# EasyEDA schematic SCH_ATC-PCB-SMD-V1.5_2024-12-07.json
TITLE: Sheet_1; REV: 1.0; Date: 2024-07-21; Sheet: 1/1; Drawn By: Edward Niedziejko; Company: Your Company
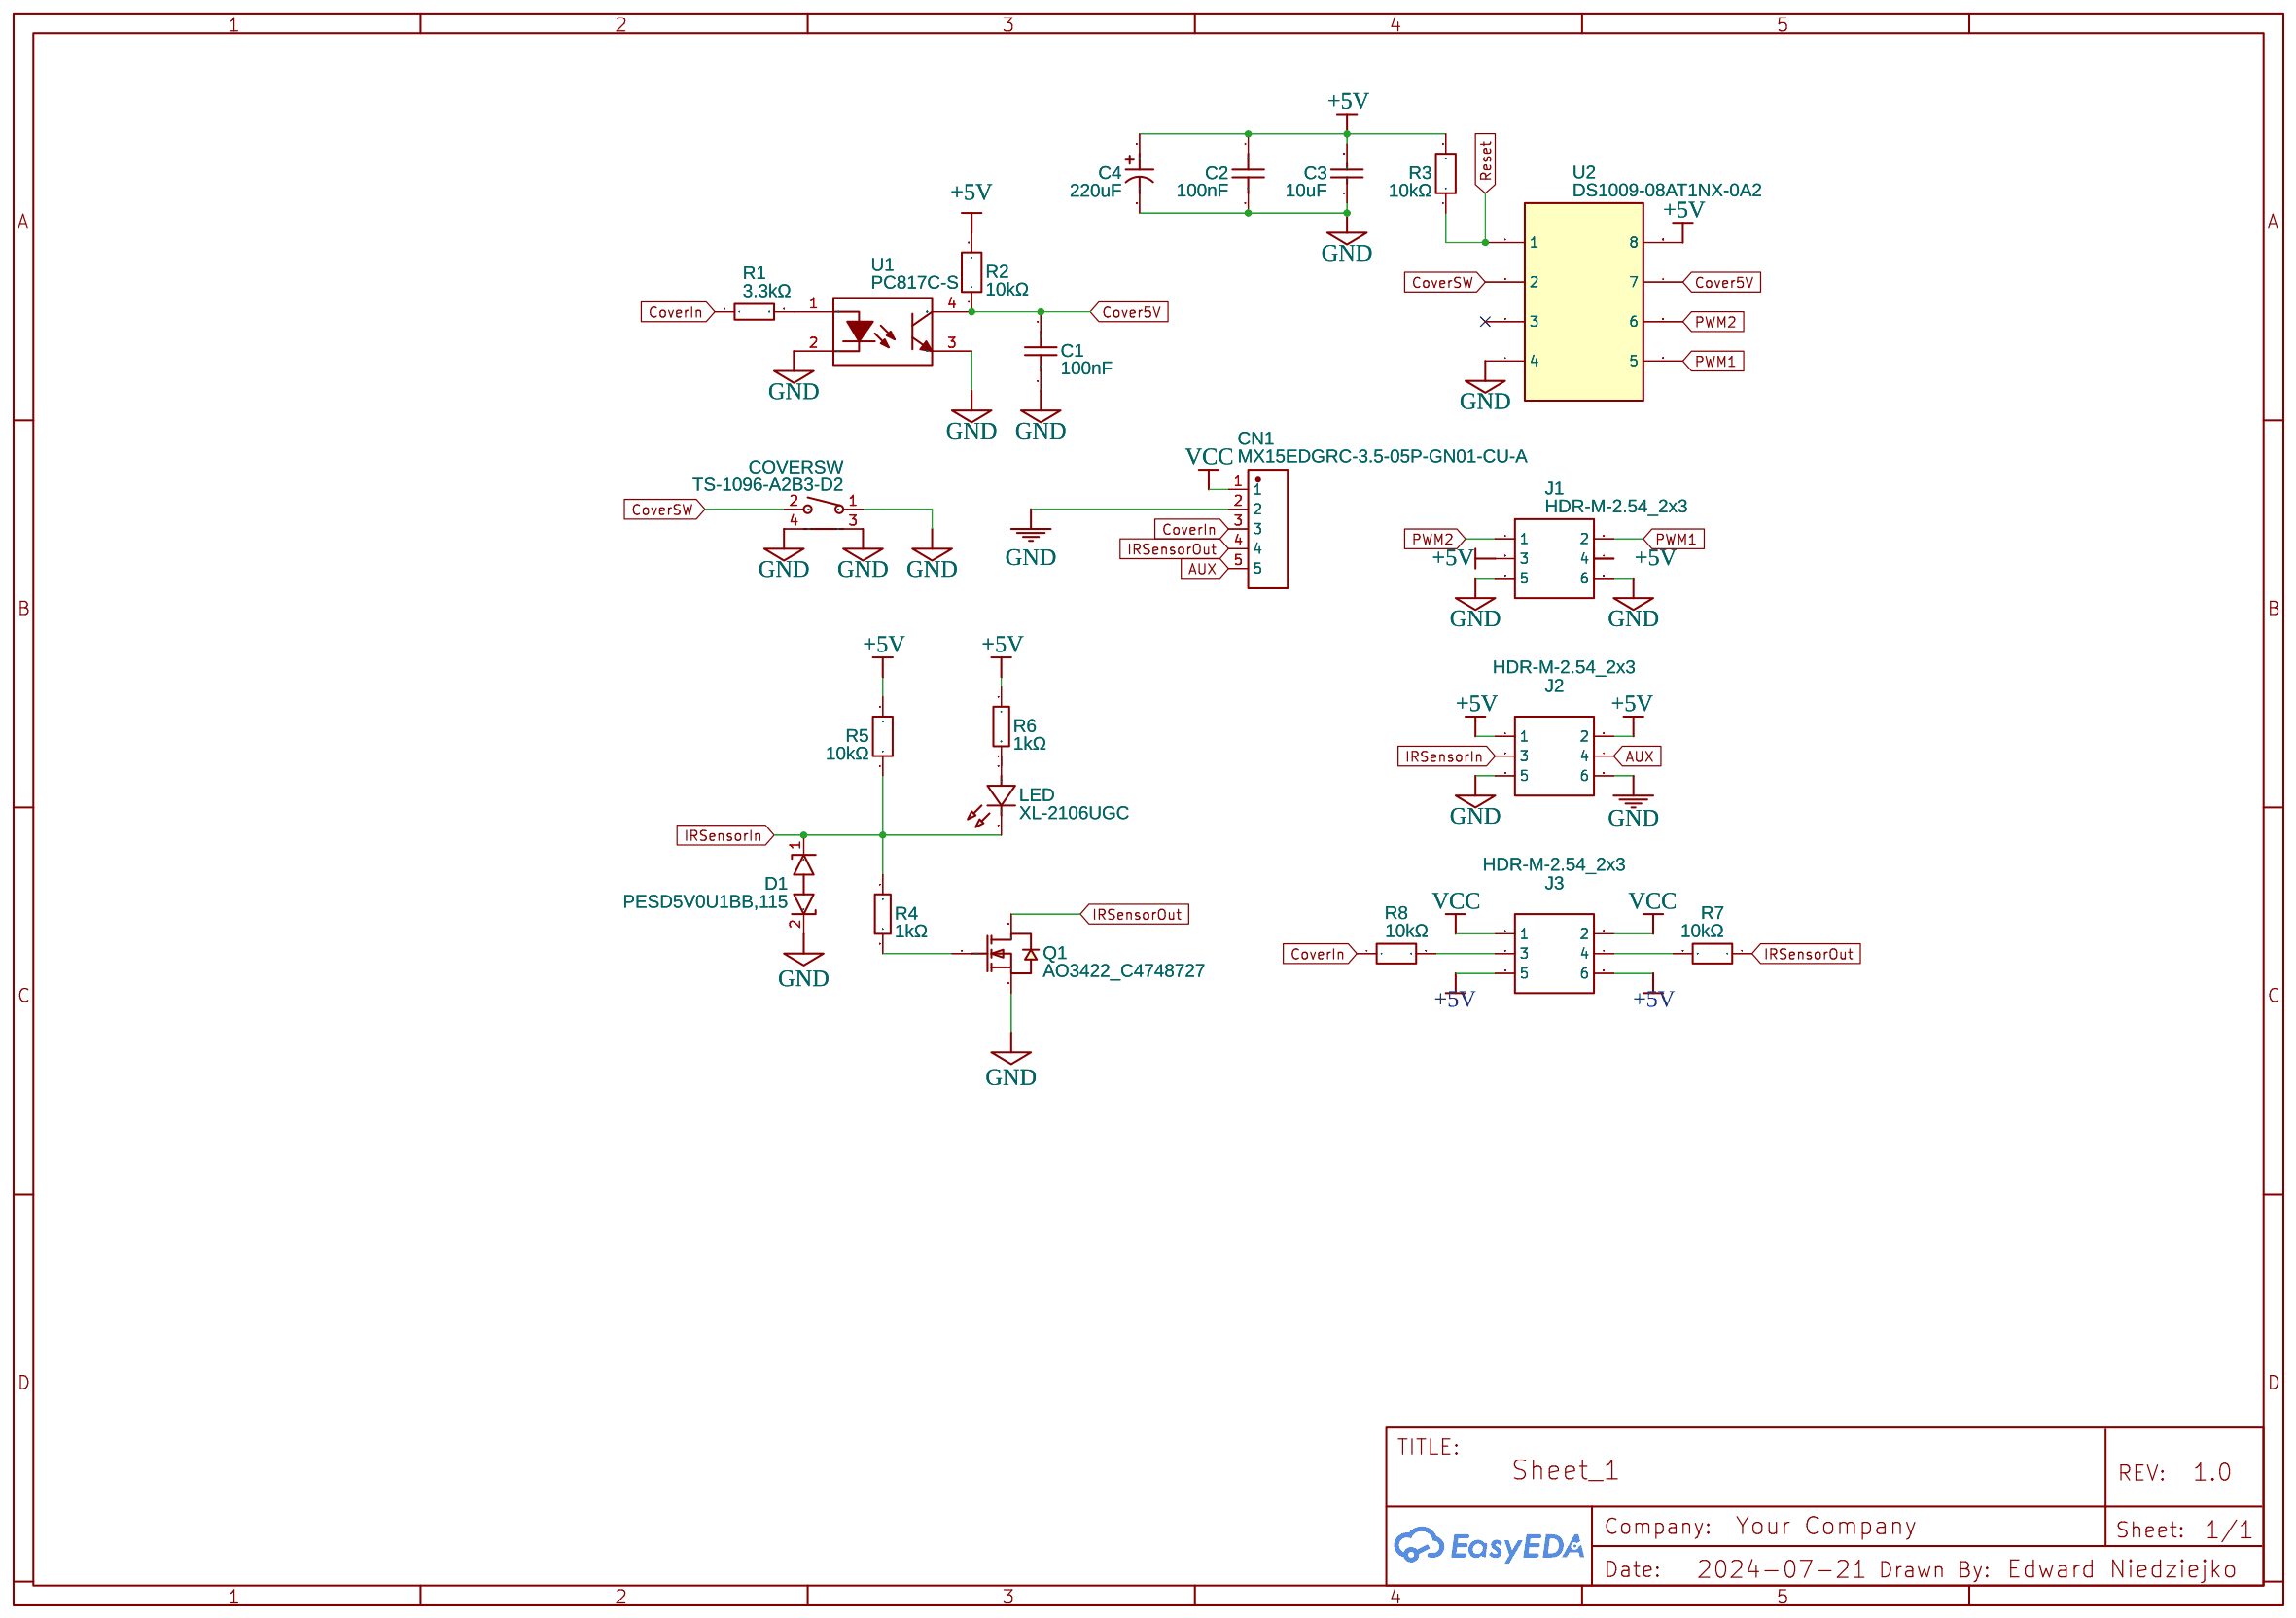
[diagram p0: schematic sheet]

## Parts
C1  100nF  [C0805]
C2  100nF  [C0805]
C3  10uF  [C0805]
C4  220uF  [CAP-SMD_L3.5-W2.8-FD]
CN1  MX15EDGRC-3.5-05P-GN01-CU-A  [CONN-TH_5P-P3.50_MX15EDGRC-3.5-05P-GN01-CU-A]
COVERSW  TS-1096-A2B3-D2  [SW-TH_TS-1096-A2B3-D2]
D1  PESD5V0U1BB,115  [SOD-523_L1.2-W0.8-LS1.6-BI]
J1  HDR-M-2.54_2x3  [HDR-M-2.54_2X3]
J2  HDR-M-2.54_2x3  [HDR-M-2.54_2X3]
J3  HDR-M-2.54_2x3  [HDR-M-2.54_2X3]
LED  XL-2106UGC  [LED-SMD_L2.1-W1.0-FD_ORANGE]
Q1  AO3422_C4748727  [SOT-23-3_L2.9-W1.6-P1.90-LS2.8-BR]
R1  3.3kΩ  [R0805]
R2  10kΩ  [R0805]
R3  10kΩ  [R0805]
R4  1kΩ  [R0805]
R5  10kΩ  [R0805]
R6  1kΩ  [R0805]
R7  10kΩ  [R0805]
R8  10kΩ  [R0805]
U1  PC817C-S  [SOP-4_L6.5-W4.6-P2.54-LS10.3-TL]
U2  DS1009-08AT1NX-0A2  [DIP-8_L10.2-W10.2-P2.54-LS7.6-BL]

## Library data of the parts
C1 C2 = CC0805JRX7R7BB104: Contributor: lcsc; Supplier: LCSC; Supplier Part: C520082; Manufacturer: YAGEO(国巨); JLCPCB Part Class: Extended Part
C3 = GRM21BB31C106KE15L: Contributor: LCSC; Supplier: LCSC; Supplier Part: C162317; Manufacturer: muRata(村田); JLCPCB Part Class: Extended Part
C4 = CA45-B-6.3V-220UF-M: Contributor: LCSC; Supplier: LCSC; Supplier Part: C2887903; Manufacturer: CEC(振华新云); JLCPCB Part Class: Extended Part
CN1 = MX15EDGRC-3.5-05P-GN01-CU-A: Supplier: LCSC; Supplier Part: C5188298; Manufacturer: MAX(迈旭); Manufacturer Part: MX15EDGRC-3.5-05P-GN01-Cu-A; Contributor: lcsc; JLCPCB Part Class: Extended Part
COVERSW = TS-1096-A2B3-D2: Contributor: LCSC; Supplier: LCSC; Supplier Part: C493000; Manufacturer: Yuandi(元迪); JLCPCB Part Class: Extended Part
D1 = PESD5V0U1BB,115: Contributor: LCSC; Supplier Part: C85388; Supplier: LCSC; Manufacturer: Nexperia(安世); JLCPCB Part Class: Extended Part
J1-J3 = HDR-M-2.54_2x3: Supplier Part: C65114; Supplier: LCSC; Contributor: LCEDA_Lib
LED = XL-2106UGC: Supplier: LCSC; Supplier Part: C965870; Manufacturer: XINGLIGHT(成兴光); JLCPCB Part Class: Extended Part; Contributor: lcsc
Q1 = AO3422_C4748727: Contributor: lcsc; Supplier: LCSC; Supplier Part: C4748727; Manufacturer: HXY MOSFET(华轩阳电子); Manufacturer Part: AO3422-HXY; JLCPCB Part Class: Extended Part
R1 = RK73H2ATTD3301F: Contributor: LCSC; Supplier: LCSC; Manufacturer: KOA; Supplier Part: C160077; JLCPCB Part Class: Extended Part
R2 R3 R5 R7 R8 = SCR0805F10K: Contributor: lcsc; Supplier: LCSC; Supplier Part: C3016734; Manufacturer: VO(翔胜); JLCPCB Part Class: Extended Part
R4 R6 = CR0805-FX-1001ELF: Contributor: LCSC; Supplier: LCSC; Supplier Part: C204136; Manufacturer: BOURNS; JLCPCB Part Class: Extended Part
U1 = PC817C-S: Contributor: lcsc; Supplier: LCSC; Supplier Part: C3008369; Manufacturer: UMW(友台半导体); JLCPCB Part Class: Extended Part
U2 = DS1009-08AT1NX-0A2: Supplier: LCSC; Manufacturer: CONNFLY; Supplier Part: C72124; JLCPCB Part Class: Extended Part

## Nets
+5V: C2.1 C3.2 C4.1 J1.3 J1.4 J2.1 J2.2 J3.5 J3.6 R2.2 R3.2 R5.2 R6.1 U2.8
GND: C1.2 C2.2 C3.1 C4.2 CN1.2 COVERSW.1 COVERSW.3(EP) COVERSW.4(EP) D1.2 J1.5 J1.6 J2.5 J2.6 Q1.2(S) U1.2(CAT) U1.3(EM) U2.4
VCC: CN1.1 J3.1 J3.2
AUX: CN1.5 J2.4
Cover5V: C1.1 R2.1 U1.4(COL) U2.7
CoverIn: CN1.3 R1.1 R8.1
CoverSW: COVERSW.2 U2.2
IRSensorIn: D1.1 J2.3 LED.1(K) R4.1 R5.1
IRSensorOut: CN1.4 Q1.3(D) R7.1
PWM1: J1.2 U2.5
PWM2: J1.1 U2.6
Reset: R3.1 U2.1
Net-(J3-3): J3.3 R8.2
Net-(J3-4): J3.4 R7.2
Net-(LED-2): LED.2(A) R6.2
Net-(Q1-1): Q1.1(G) R4.2
Net-(R1-2): R1.2 U1.1(AN)

Not connected (* = marked no-connect by the designer): U2 3*
